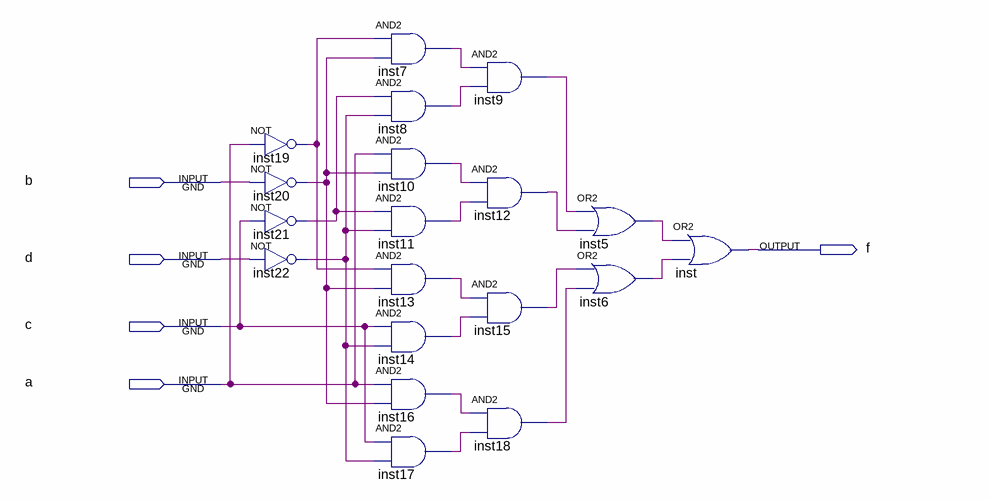
[diagram p0: schematic sheet]
// Quartus schematic 2-3-before.bdf as structural Verilog: 19 symbols, 5 pins
module \2-3-before  (
  input  b,
  input  d,
  input  c,
  input  a,
  output f
);

  wire inst5_out, inst6_out, inst7_out, inst8_out, inst9_out, inst10_out, inst11_out, inst12_out, inst13_out,
       inst14_out, inst15_out, inst16_out, inst17_out, inst18_out, inst19_out, inst20_out, inst21_out,
       inst22_out;

  not inst19 (inst19_out, a);
  not inst20 (inst20_out, b);
  not inst21 (inst21_out, c);
  not inst22 (inst22_out, d);
  and inst7 (inst7_out, inst19_out, inst20_out);
  and inst8 (inst8_out, inst21_out, inst22_out);
  and inst10 (inst10_out, a, inst20_out);
  and inst11 (inst11_out, inst21_out, inst22_out);
  and inst13 (inst13_out, inst19_out, inst20_out);
  and inst14 (inst14_out, c, inst22_out);
  and inst16 (inst16_out, a, inst20_out);
  and inst17 (inst17_out, c, inst22_out);
  and inst9 (inst9_out, inst7_out, inst8_out);
  and inst12 (inst12_out, inst10_out, inst11_out);
  and inst15 (inst15_out, inst13_out, inst14_out);
  and inst18 (inst18_out, inst16_out, inst17_out);
  or inst5 (inst5_out, inst9_out, inst12_out);
  or inst6 (inst6_out, inst15_out, inst18_out);
  or inst (f, inst5_out, inst6_out);
endmodule
